# EAGLE design timer_remote (EAGLE 9.6.2)
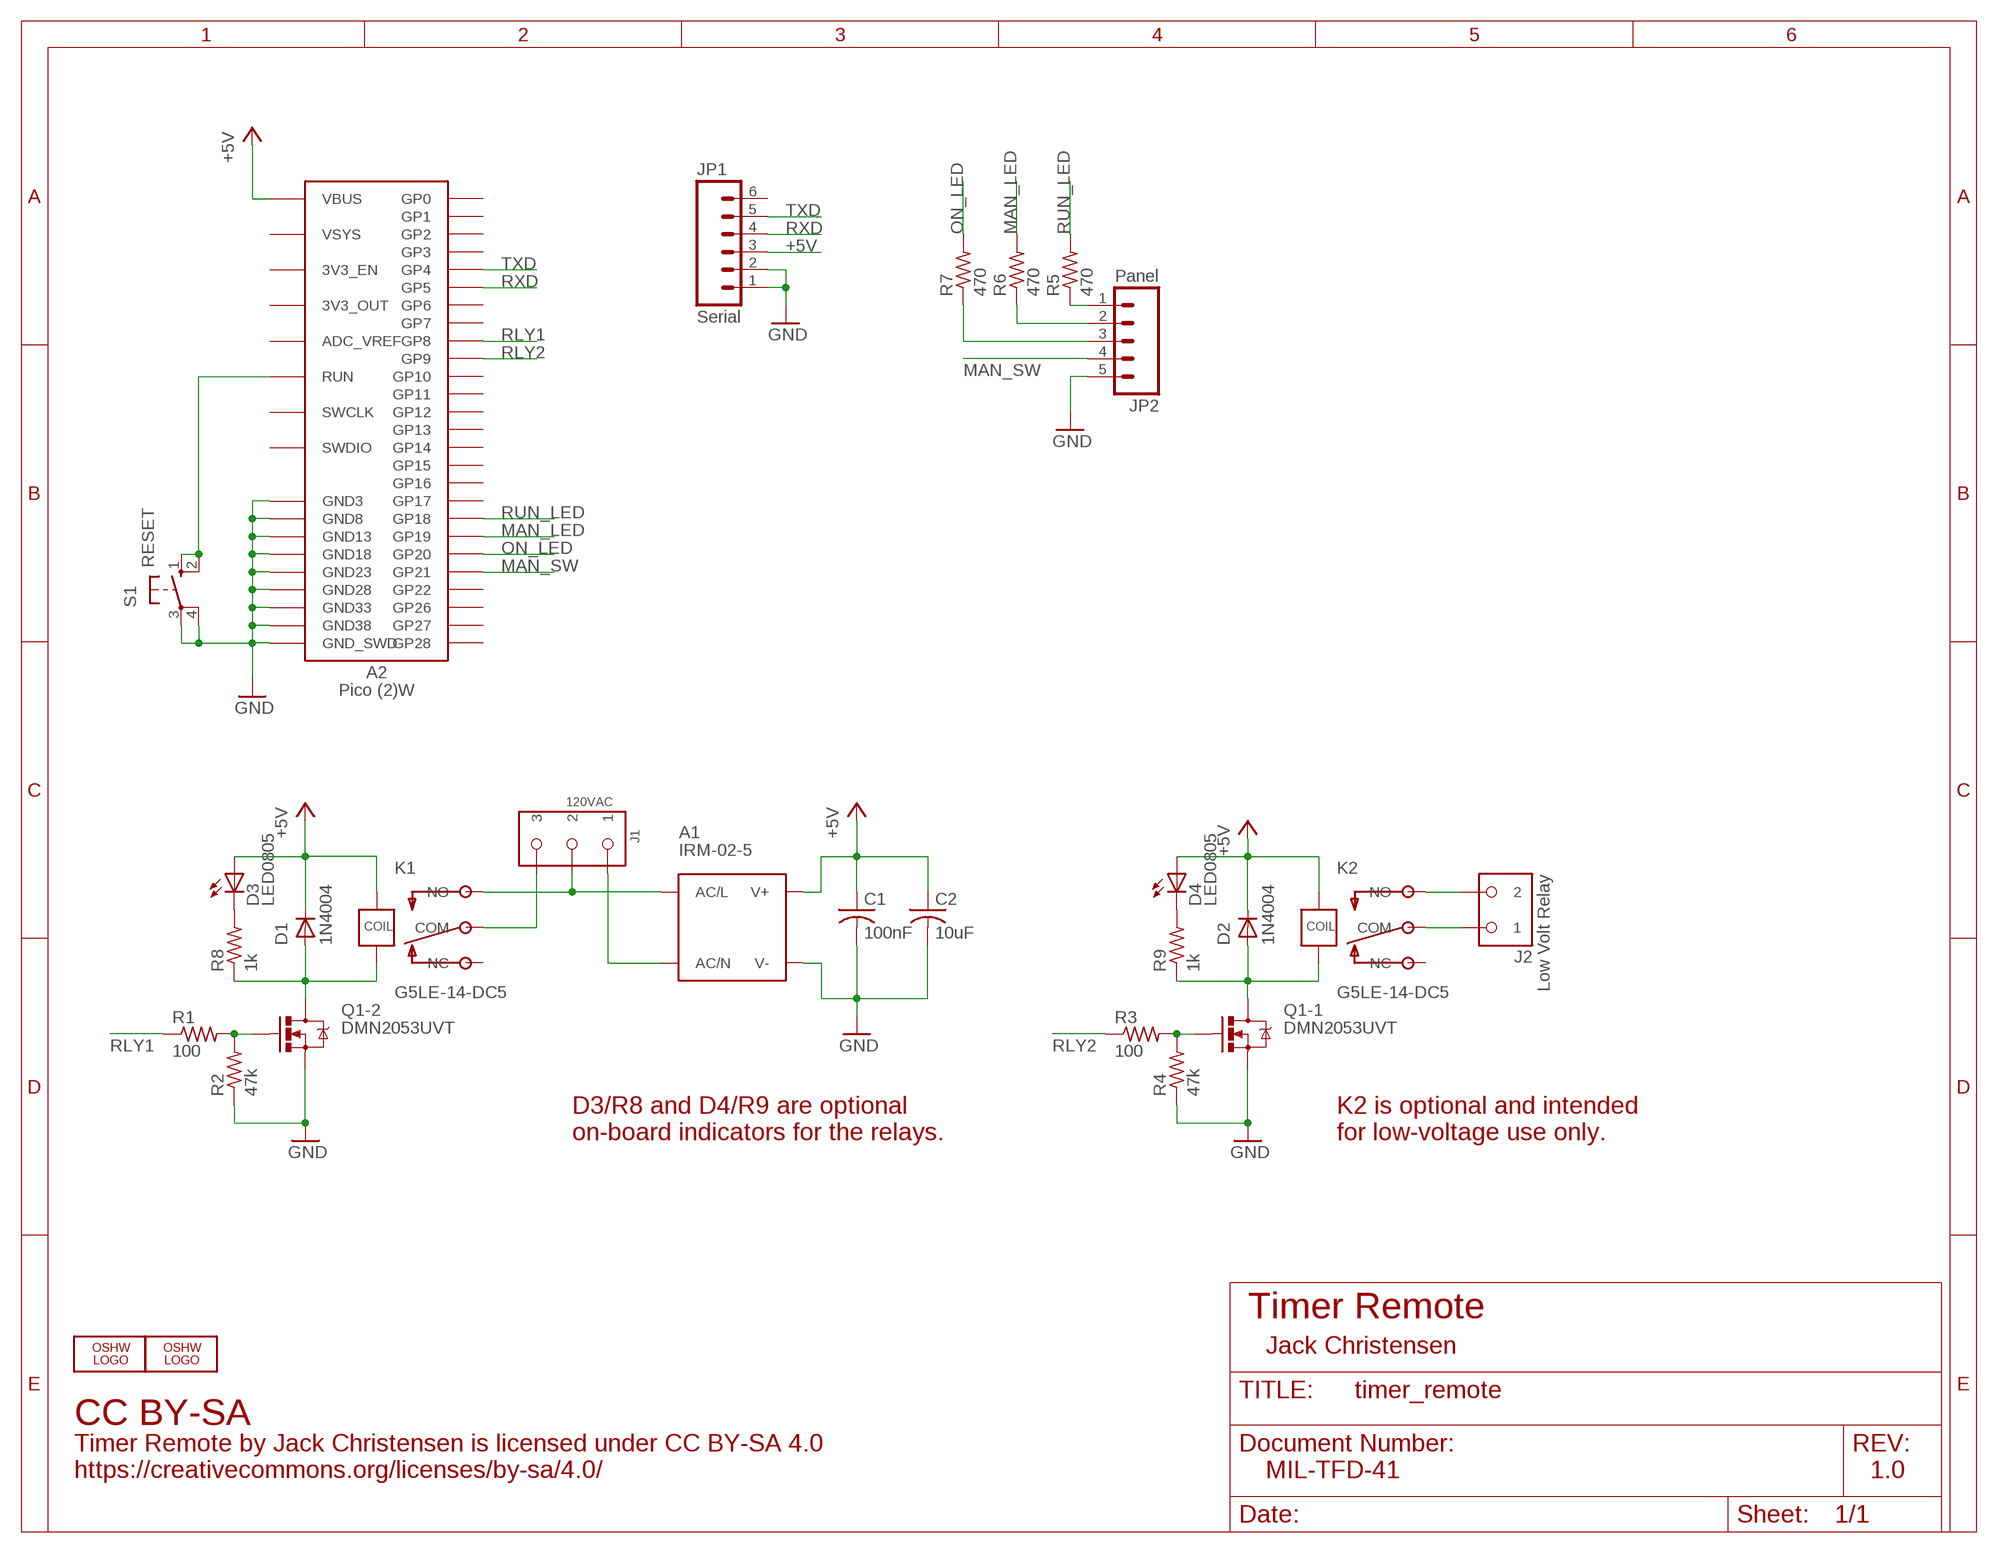
[diagram p0: schematic, sheet 1]

## Parts
A1  IRM-02-5  IRM-01  [IRM-01]
A2  Pico (2)W  PICOPICO  [PICO]
C1  100nF  C-USM0805  [M0805]
C2  10uF  C-USM0805  [M0805]
D1  1N4004  DIODE1N400X  [1N400X]
D2  1N4004  DIODE1N400X  [1N400X]
D3  LED0805  LEDD0805A  [D0805A]
D4  LED0805  LEDD0805  [D0805]
J1  120VAC  OST-TB-35.08MM  [OST-TB-3-0.20]
J2  Low Volt Relay  OST-TB-20.20IN  [OST-TB-2-0.20]
JP1  Serial  M06LOCK  [1X06_LOCK]
JP2  Panel  M05LOCK  [1X05_LOCK]
K1  G5LE-14-DC5  RELAY-SPDT  [NAIS-JS1-5V]
K2  G5LE-14-DC5  RELAY-SPDT  [NAIS-JS1-5V]
LOGO1  OSHW_LOGO_10MILX0200-NT  [OSHW_10X200_NOTEXT]
LOGO2  OSHW_LOGO_10MILX0200-NT  [OSHW_10X200_NOTEXT]
Q1  DMN2053UVT  DUAL-MOSFETSOT23-6  [SOT23-6]
R1  100  R-US_M0805  [M0805]
R2  47k  R-US_M0805  [M0805]
R3  100  R-US_M0805  [M0805]
R4  47k  R-US_M0805  [M0805]
R5  470  R-US_M0805  [M0805]
R6  470  R-US_M0805  [M0805]
R7  470  R-US_M0805  [M0805]
R8  1k  R-US_M0805  [M0805]
R9  1k  R-US_M0805  [M0805]
S1  RESET  10-XXOCT  [B3F-10XXOCT]

## Nets
+5V: A1.V+ A2.P$40(VBUS) C1.1 C2.1 D1.K D2.K D3.A D4.A JP1.3 K1.C1 K2.C1
GND: A1.V- A2.P$03(GND3) A2.P$08(GND8) A2.P$13(GND13) A2.P$18(GND18) A2.P$23(GND23) A2.P$28(GND28) A2.P$33(GND33) A2.P$38(GND38) A2.P$SWGND(GND_SWD) C1.2 C2.2 JP1.1 JP1.2 JP2.5 Q1.2(-2:S) Q1.5(-1:S) R2.1 R4.1 S1.3(P) S1.4(P1)
MAN_LED: A2.P$25(GP19) R6.2
MAN_SW: A2.P$27(GP21) JP2.4
N$1: J2.P$2 K2.NO
N$2: J2.P$1 K2.COM
N$3: Q1.1(-1:G) R3.2 R4.2
N$4: D2.A K2.C2 Q1.6(-1:D) R9.1
N$5: A2.P$30(RUN) S1.1(S) S1.2(S1)
N$6: D1.A K1.C2 Q1.4(-2:D) R8.1
N$7: A1.AC/L J1.P$2 K1.NO
N$8: A1.AC/N J1.P$1
N$9: J1.P$3 K1.COM
N$10: Q1.3(-2:G) R1.2 R2.2
N$11: JP2.1 R5.1
N$12: D3.K(C) R8.2
N$13: JP2.2 R6.1
N$14: JP2.3 R7.1
N$15: D4.K(C) R9.2
ON_LED: A2.P$26(GP20) R7.2
RLY1: A2.P$11(GP8) R1.1
RLY2: A2.P$12(GP9) R3.1
RUN_LED: A2.P$24(GP18) R5.2
RXD: A2.P$07(GP5) JP1.4
TXD: A2.P$06(GP4) JP1.5
Unconnected: A2.P$01(GP0) A2.P$02(GP1) A2.P$04(GP2) A2.P$05(GP3) A2.P$09(GP6) A2.P$10(GP7) A2.P$14(GP10) A2.P$15(GP11) A2.P$16(GP12) A2.P$17(GP13) A2.P$19(GP14) A2.P$20(GP15) A2.P$21(GP16) A2.P$22(GP17) A2.P$29(GP22) A2.P$31(GP26) A2.P$32(GP27) A2.P$34(GP28) A2.P$35(ADC_VREF) A2.P$36(3V3_OUT) A2.P$37(3V3_EN) A2.P$39(VSYS) A2.P$SWCLK(SWCLK) A2.P$SWDIO(SWDIO) JP1.6 K1.NC K2.NC

## Notes on the sheet
- D3/R8 and D4/R9 are optional
  on-board indicators for the relays.
- K2 is optional and intended
  for low-voltage use only.
- Timer Remote
- Jack Christensen
- CC BY-SA
- Timer Remote by Jack Christensen is licensed under CC BY-SA 4.0
  https://creativecommons.org/licenses/by-sa/4.0/
- MIL-TFD-41 | 1.0

## Library data of the parts
A1 = _jc:IRM-01: Mean Well IRM-01 series 1W encapsulated power supply module.
A2 = _jc:PICO: Raspberry Pi Pico microcontroller.
C1 C2 = _jc:C-US: CAPACITOR, American symbol
D1 D2 = _jc:DIODE
D3 D4 = _jc:LED: LED OSRAM: - CHIPLED LG R971, LG N971, LY N971, LG Q971, LY Q971, LO R971, LY R971 LH N974, LH R974 LS Q976, LO Q976, LY Q976 LO Q996 - Hyper CHIPLED LW Q18S LB Q993, LB Q99A, LB R99A - SideLED LS A670, LO A670, LY A670, LG A670, LP A670 LB A673, LV A673, LT A673, LW A673 LH A674 LY A675 LS A676, LA A676, LO A676, LY A676, LW A676 LS A679, LY A679, LG A679 - Hyper Micro SIDELED® LS Y876, LA Y876, LO Y876, LY Y876 LT Y87S - SmartLED LW L88C, LW L88S LB L89C, LB L89S, LG L890 LS L89K, LO L89K, LY L89K LS L896, LA L896, LO L896, LY L896 - TOPLED LS T670, LO T670, LY T670, LG T670, LP T670 LSG T670, LSP T670, LSY T670, LOP T670, LYG T670 LG T671, LOG T671, LSG T671 LB T673, LV T673, LT T673, LW T673 LH T674 LS T676, LA T676, LO T676, LY T676, LB T676, LH T676, LSB T676, LW T676 LB T67C, LV T67C, LT T67C, LS T67K, LO T67K, LY T67K, LW E67C LS E67B, LA E67B, LO E67B, LY E67B, LB E67C, LV E67C, LT E67C LW T67C LS T679, LY T679, LG T679 LS T770, LO T770, LY T770, LG T770, LP T770 LB T773, LV T773, LT T773, LW T773 LH T774 LS E675, LA E675, LY E675, LS T675 LS T776, LA T776, LO T776, LY T776, LB T776 LHGB T686 LT T68C, LB T68C - Hyper Mini TOPLED® LB M676 - Mini TOPLED Santana® LG M470 LS M47K, LO M47K, LY M47K Source: http://www.osram.convergy.de/
J1 = _jc:OST-TB-3
J2 = _jc:OST-TB-2
JP1 = SparkFun:M06: Header 6 Standard 6-pin 0.1" header. Use with straight break away headers (SKU : PRT-00116), right angle break away headers (PRT-00553), swiss pins (PRT-00743), machine pins (PRT-00117), and female headers (PRT-00115). Molex polarized connector foot print use with SKU : PRT-08094 with associated crimp pins and housings. NOTES ON THE VARIANTS LOCK and LOCK_LONGPADS... This footprint was designed to help hold the alignment of a through-hole component (i.e. 6-pin header) while soldering it into place. You may notice that each hole has been shifted either up or down by 0.005 of an inch from it's more standard position (which is a perfectly straight line). This slight alteration caused the pins (the squares in the middle) to touch the edges of the holes. Because they are alternating, it causes a "brace" to hold the component in place. 0.005 has proven to be the perfect amount of "off-center" position when using our standard breakaway headers. Although looks a little odd when you look at the bare footprint, once you have a header in there, the alteration is very hard to notice. Also, if you push a header all the way into place, it is covered up entirely on the bottom side. This idea of altering the position of holes to aid alignment will be further integrated into the Sparkfun Library for other footprints. It can help hold any component with 3 or more connection pins.
JP2 = SparkFun:M05: Header 5 Standard 5-pin 0.1" header. Use with straight break away headers (SKU : PRT-00116), right angle break away headers (PRT-00553), swiss pins (PRT-00743), machine pins (PRT-00117), and female headers (PRT-00115). Molex polarized connector foot print use with SKU : PRT-08230 with associated crimp pins and housings.
K1 K2 = _jc:RELAY-SPDT
LOGO1 LOGO2 = ohw-logo:OSHW_LOGO_10MIL
Q1 = _jc:DUAL-MOSFET: e.g. Fairchild/ON Semi FDG6303N
R1-R9 = _jc:R-US_: RESISTOR, American symbol
S1 = _jc:10-XX: OMRON SWITCH

## Board
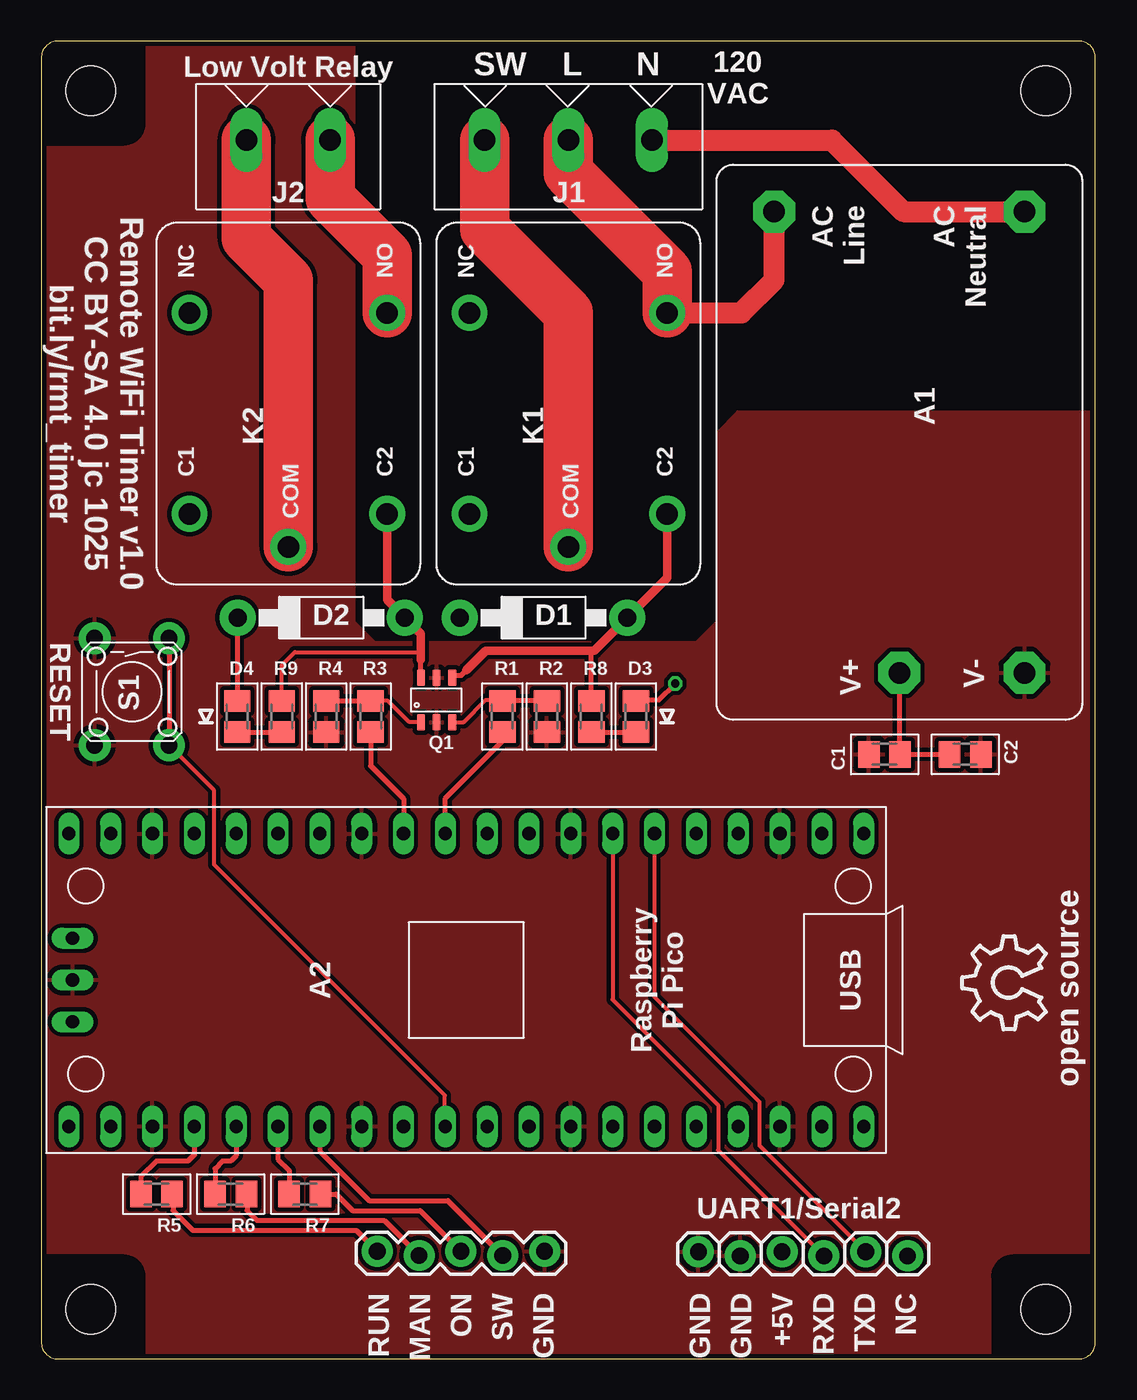
[diagram p1: board, top side]
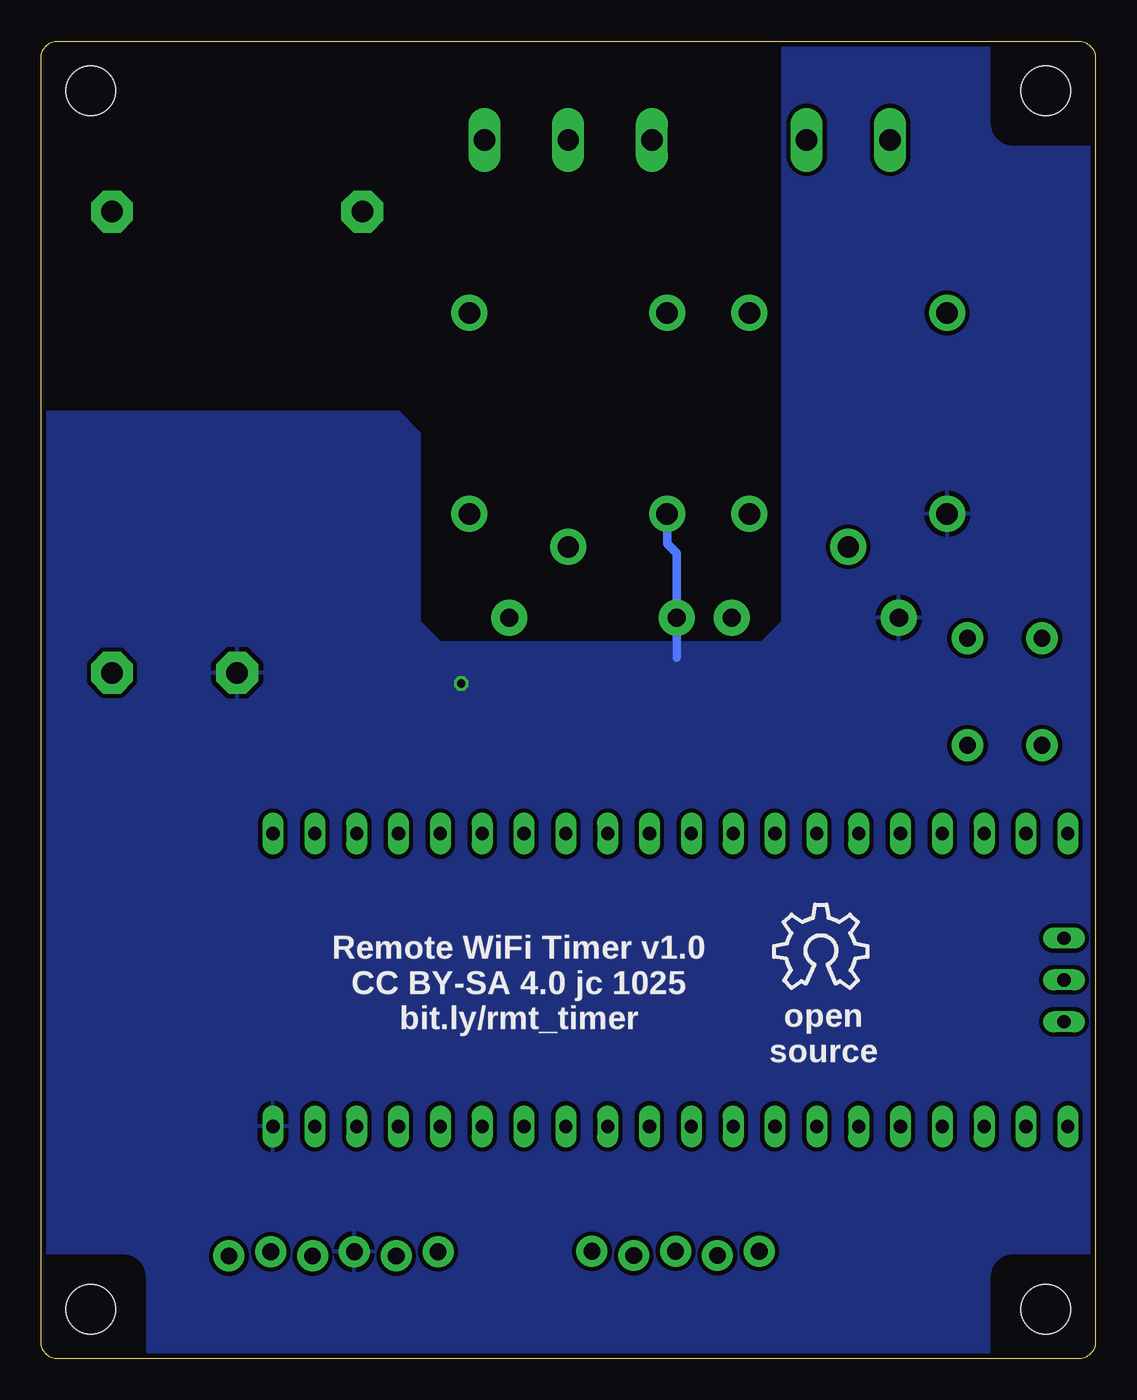
[diagram p2: board, bottom side, seen from below]

Size 64 x 80 mm. Coordinates in mm from the lower left corner, seen from the top.
Outline: 0,79 0,1 arc90 1,0 63,0 arc90 64,1 64,79 arc90 63,80 1,80 arc90 0,79
Copper layers (1*16): Top 0.0356mm / dielectric 1.5011mm / Bottom 0.0356mm
Design rules "oshpark-2layer-jc": minimum track width 8mil, minimum drill 13mil, track to track 8mil, track to pad 8mil, pad to pad 8mil, via to via 8mil, smd to smd 6mil, copper to edge 12mil, drill to drill 6mil, minimum pad ring 7mil, minimum via ring 7mil, stop-mask expansion 2.5mil, vias tented up to drill 20mil, thermal gap 12mil
Holes 3 mm at 3,3 3,77 61,77 61,3
tRestrict: area 0,0 to 6,6; area 0,74 to 6,80; area 58,74 to 64,80; area 58,0 to 64,6
bRestrict: area 0,0 to 6,6; area 0,74 to 6,80; area 58,0 to 64,6; area 58,74 to 64,80

### Footprints (pad centres in the part's own frame; a part is rotated, then mirrored left to right if it is on the bottom)
IRM-01 = drill 1.3 pad 2.54 octagon: AC/L 2.85,3.5; AC/N 2.85,18.7; V+ 30.85,11.1; V- 30.85,18.7
PICO = drill 0.8 pad 1.27 long: P$01 1.61,49.63; P$02 1.61,47.09; P$03 1.61,44.55; P$04 1.61,42.01; P$05 1.61,39.47; P$06 1.61,36.93; P$07 1.61,34.39; P$08 1.61,31.85; P$09 1.61,29.31; P$10 1.61,26.77; P$11 1.61,24.23; P$12 1.61,21.69; P$13 1.61,19.15; P$14 1.61,16.61; P$15 1.61,14.07; P$16 1.61,11.53; P$17 1.61,8.99; P$18 1.61,6.45; P$19 1.61,3.91; P$20 1.61,1.37; P$21 19.39,1.37; P$22 19.39,3.91; P$23 19.39,6.45; P$24 19.39,8.99; P$25 19.39,11.53; P$26 19.39,14.07; P$27 19.39,16.61; P$28 19.39,19.15; P$29 19.39,21.69; P$30 19.39,24.23; P$31 19.39,26.77; P$32 19.39,29.31; P$33 19.39,31.85; P$34 19.39,34.39; P$35 19.39,36.93; P$36 19.39,39.47; P$37 19.39,42.01; P$38 19.39,44.55; P$39 19.39,47.09; P$40 19.39,49.63; P$SWCLK 7.96,1.6; P$SWDIO 13.04,1.6; P$SWGND 10.5,1.6
M0805 = smd 1.3 x 1.6: 1 -0.95,0; 2 0.95,0
1N400X = drill 1.1 pad 2.184: A 5.08,0; K -5.08,0
D0805A = smd 1.3 x 1.6: A -0.95,0; K 0.95,0
D0805 = smd 1.3 x 1.6: A -0.95,0; K 0.95,0
OST-TB-3-0.20 = drill 1.3 long: P$1 -5.08,0; P$2 0,0; P$3 5.08,0
OST-TB-2-0.20 = drill 1.3 long: P$1 2.548,-0.009; P$2 -2.532,-0.009
1X06_LOCK = drill 1.016 pad 1.88: 1 0,0; 2 2.54,-0.254; 3 5.08,0; 4 7.62,-0.254; 5 10.16,0; 6 12.7,-0.254
1X05_LOCK = drill 1.016 pad 1.88: 1 0,0.127; 2 2.54,-0.127; 3 5.08,0.127; 4 7.62,-0.127; 5 10.16,0.127
NAIS-JS1-5V = drill 1.3 pad 2.184: C1 -6.7,6; C2 -6.7,-6; COM -8.7,0; NC 5.5,6; NO 5.5,-6
SOT23-6 = smd 0.508 x 1.016: 1 -0.95,-1.35; 2 0,-1.35; 3 0.95,-1.35; 4 0.95,1.35; 5 0,1.35; 6 -0.95,1.35
B3F-10XXOCT = drill 1.016 pad 1.93: 1 -3.251,2.261; 2 3.251,2.261; 3 -3.251,-2.261; 4 3.251,-2.261

### Placement (x,y rotation side)
A1  41,72.5 270 top
A2  0.3,33.5 270 top
C1  51.2,36.7 180 top
C2  56.1,36.7 0 top
D1  30.5,45 0 top
D2  17,45 0 top
D3  36.1,39 270 top
D4  11.9,39 270 top
J1  32,74 180 top
J2  15,74 180 top
JP1  39.9,6.5 0 top
JP2  20.4,6.4 0 top
K1  32,58 90 top
K2  15,58 90 top
LOGO1  61,20 90 top
LOGO2  19.5,22.5 0 bottom
Q1  24,40 0 top
R1  28,39 90 top
R2  30.7,39 90 top
R3  20,39 90 top
R4  17.3,39 90 top
R5  7,10 180 top
R6  11.5,10 180 top
R7  16,10 180 top
R8  33.4,39 270 top
R9  14.6,39 270 top
S1  5.5,40.5 270 top

### Tracks (layer width: path | path; a pad name or v marks a point on that pad's centre or on a via)
+5V  (via drill 0.5)
  Top 0.305: D2.K 11.9,44.98 D4.A | D3.A 36.15,40 37.5,40 v38.5,41 | A1.V+ 52.1,36.75 C1.1 C2.1
  Bottom 0.508: 25.42,42.58 D1.K 25.42,48.92 26,49.5 K1.C1
  pour Bottom (isolate 0.254): -2,82 -2,-2 66,-2 66,57.5 42.27,57.5 41,56.23 41,44.77 39.73,43.5 20.27,43.5 19,44.77 19,82
GND
  pour Top (isolate 0.254): -1,-1 65,-1 65,57.5 42.27,57.5 41,56.23 41,44.77 39.73,43.5 20.27,43.5 19,44.77 19,81 -1,81
MAN_LED
  Top 0.305: A2.P$25 11.83,12.33 11.5,12 11,12 10.55,11.55 R6.2
MAN_SW
  Top 0.305: A2.P$27 16.91,12.59 19.9,9.6 24.69,9.6 JP2.4
N$1
  Top 3: J2.P$2 17.53,70.47 21,67 K2.NO
N$2
  Top 3: J2.P$1 12.45,68.05 15,65.5 K2.COM
N$3
  Top 0.254: Q1.1 22.35,38.65 21.05,39.95 R3.2
  Top 0.305: R4.2 R3.2
N$4
  Top 0.254: 23.05,42.9 15.4,42.9 14.6,42.1 R9.1
  Top 0.305: Q1.6 23.05,42.45
  Top 0.508: K2.C2 21,46.08 D2.A 23.05,44.03 23.05,42.9 23.05,42.45
N$5
  Top 0.254: A2.P$30 24.5,14.14 24.5,16 10.5,30 10.5,34.51 S1.2
  Top 0.305: S1.1 S1.2
N$6
  Top 0.305: Q1.4 25.1,41.5 25.5,41.5 25.8,41.8 | R8.1 33.4,42.9 33.5,43
  Top 0.508: K1.C2 38,47.42 D1.A 33.58,43 33.5,43 27,43 25.8,41.8
N$7
  Top 1.27: K1.NO 42.5,63.5 44.5,65.5 A1.AC/L
  Top 3: J1.P$2 32,72 38,66 K1.NO
N$8
  Top 1.27: J1.P$1 48,74 52.35,69.65 A1.AC/N
N$9
  Top 3: K1.COM 32,63.5 26.92,68.58 J1.P$3
N$10
  Top 0.254: Q1.3 25.65,38.65 27,40 27.95,40 R1.2
  Top 0.305: R2.2 R1.2
N$11
  Top 0.305: R5.1 8,9.95 8,9 9.2,7.8 19.13,7.8 JP2.1
N$12
  Top 0.305: R8.2 D3.K
N$13
  Top 0.305: R6.1 12.5,9.95 12.5,9 13.1,8.4 20.81,8.4 JP2.2
N$14
  Top 0.305: R7.1 17.9,10 18.9,9 23.01,9 JP2.3
N$15
  Top 0.305: D4.K R9.2
ON_LED
  Top 0.305: A2.P$26 14.37,12.13 15.05,11.45 R7.2
RLY1
  Top 0.305: A2.P$11 24.53,34.03 28,37.5 R1.1
RLY2
  Top 0.305: R3.1 20,36 22,34 A2.P$12
RUN_LED
  Top 0.305: A2.P$24 9.29,12.39 8.9,12 7,12 6.05,11.05 R5.2
RXD
  Top 0.254: JP1.4 41.1,12.67 41.1,15.4 34.69,21.81 A2.P$07
TXD
  Top 0.254: JP1.5 43.6,12.96 43.6,15.6 37.23,21.97 A2.P$06

### Text on the board
tPlace: SW L N | 120 / VAC | Remote WiFi Timer v1.0 / CC BY-SA 4.0 jc 1025 / bit.ly/rmt_timer | RESET | open source | UART1/Serial2 | RUN | MAN | ON | SW | GND | GND | GND | +5V | RXD | TXD | NC
bPlace: Remote WiFi Timer v1.0 / CC BY-SA 4.0 jc 1025 / bit.ly/rmt_timer | open / source